# Altium schematic sheet Photodiode.SchDoc
size 420 x 297 mm; Address1: Address1; Address2: Address2; Address3: Address3; Address4: Address4; DocumentNumber: *Э3; SheetNumber: 2; SheetTotal: 11; DocumentType: Схема электрическая *
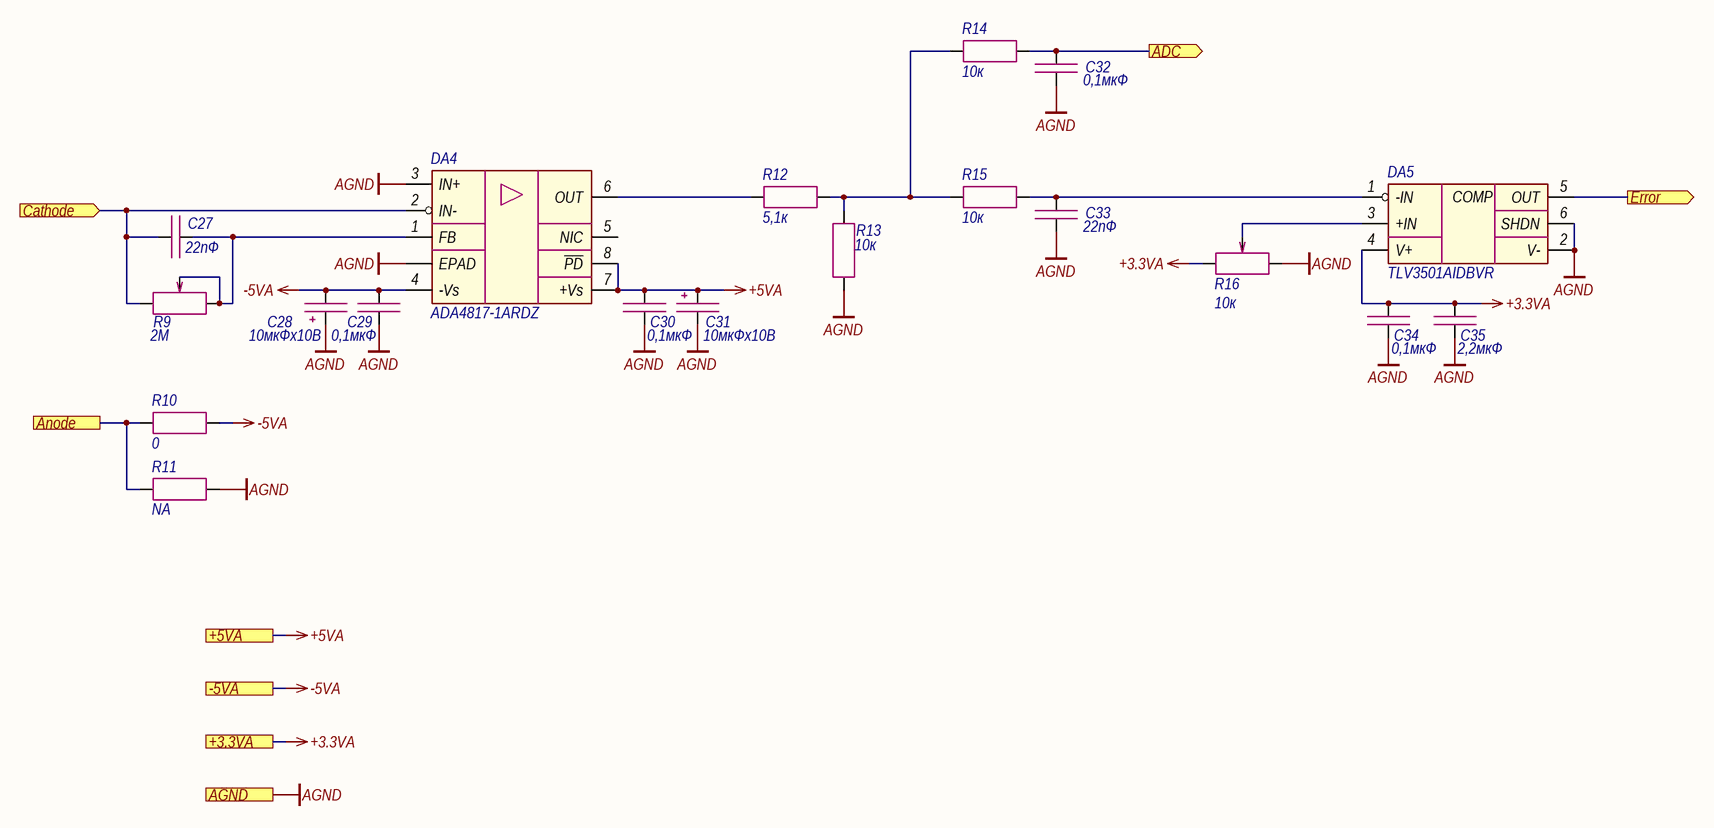
[diagram p0: Photodiode.SchDoc]

## Parts
C27  22пФ  [CAP_0603]
C28  10мкФх10B  [CAP_A]
C29  0,1мкФ  [CAP_0603]
C30  0,1мкФ  [CAP_0603]
C31  10мкФх10B  [CAP_A]
C32  0,1мкФ  [CAP_0603]
C33  22пФ  [CAP_0603]
C34  0,1мкФ  [CAP_0603]
C35  2,2мкФ  [CAP_0603]
DA4  ADA4817-1ARDZ  [SOIC-8 EPAD]
DA5  TLV3501AIDBVR  [SOT-23-6]
R9  2М  [3224W]
R10  0  [RES_0603]
R11  NA  [RES_0603]
R12  5,1к  [RES_0603]
R13  10к  [RES_0603]
R14  10к  [RES_0603]
R15  10к  [RES_0603]
R16  10к  [3224W]

## Ports
+3.3VA (see Main[2A], Hardwiring[4D], LD_driver[1D], Thermistor[2C]), +5VA (see Main[1A], Hardwiring[3D], LD_driver[1D]), -5VA (see Main[1A]), ADC (out, see Main[2A]), AGND (see Main[2A], Hardwiring[4D], LD_driver[1D], Thermistor[2C]), Anode (see Main[1A]), Cathode (in, see Main[1A]), Error (out, see Main[2A])

## Nets
+3.3VA: C34.1 C35.1 DA5.4(V+) R16.3 ; port +3.3VA
+5VA: C30.1 C31.1 DA4.7(+Vs) DA4.8(~{PD}) ; port +5VA
-5VA: C28.2 C29.1 DA4.4(-Vs) R10.1 ; port -5VA
AGND: C28.1 C29.2 C30.2 C31.2 C32.2 C33.2 C34.2 C35.2 DA4.3(IN+) DA4.EPAD DA5.2(V-) DA5.6(SHDN) R11.2 R13.2 R16.1 ; port AGND
ADC: C32.1 R14.2 ; port ADC
Anode: R10.2 R11.1 ; port Anode
Cathode: C27.2 DA4.2(IN-) R9.1 ; port Cathode
Error: DA5.5(OUT) ; port Error
NetC27_1: C27.1 DA4.1(FB) R9.2 R9.3
NetC33_1: C33.1 DA5.1(-IN) R15.2
NetDA4_6: DA4.6(OUT) R12.1
NetDA5_3: DA5.3(+IN) R16.2
NetR12_2: R12.2 R13.1 R14.1 R15.1

Not connected (* = marked no-connect by the designer): DA4 5(NIC)

## Notes on the sheet
- Подп. и дата
- Инв. № дубл.
- Взам. инв. №
- Инв. № подл.
- Изм.
- Лист
- № докум.
- Подп.
- Дата
- Копировал
- Формат А3
- (in symbol TLV3501) COMP

## Library data of the parts
C27 C33 = Capacitor: Manufacturer: Murata; Model: GRM1885C1H220JA01D; Value: 22пФ; Document: *
C28 C31 = Capacitor_Polar: Model: TECAP, 10 мкФ, 10 В, тип A, 10%; Value: 10мкФх10B; Document: *; Manufacturer: *
C29 C30 C32 C34 = Capacitor: Manufacturer: Murata; Model: GRM188R71H104KA93D; Value: 0,1мкФ; Document: *
C35 = Capacitor: Manufacturer: Murata; Model: GRM188R61H225KE11D; Value: 2,2мкФ; Document: *
DA4 = ADA4817-1ARDZ: Manufacturer: Analog Devices; Model: ADA4817-1ARDZ; Document: *
DA5 = TLV3501: Manufacturer: Texas Instruments; Model: TLV3501AIDBVR; Document: *
R9 = Resistor_Variable: Manufacturer: Bourns; Model: 3224W-1-205E; Value: 2М; Document: *
R10 = Resistor: Manufacturer: Yageo; Model: RC0603FR-070RL; Value: 0; Document: *
R11 = Resistor: Value: NA; Model: *; Document: *; Manufacturer: *
R12 = Resistor: Manufacturer: Yageo; Model: RC0603FR-075K1L; Value: 5,1к; Document: *
R13-R15 = Resistor: Manufacturer: Yageo; Model: RC0603FR-0710KL; Value: 10к; Document: *
R16 = Resistor_Variable: Manufacturer: Bourns; Model: 3224W-1-103; Value: 10к; Document: *